# Altium project MBP-GPU-Upgrade.PrjPcb
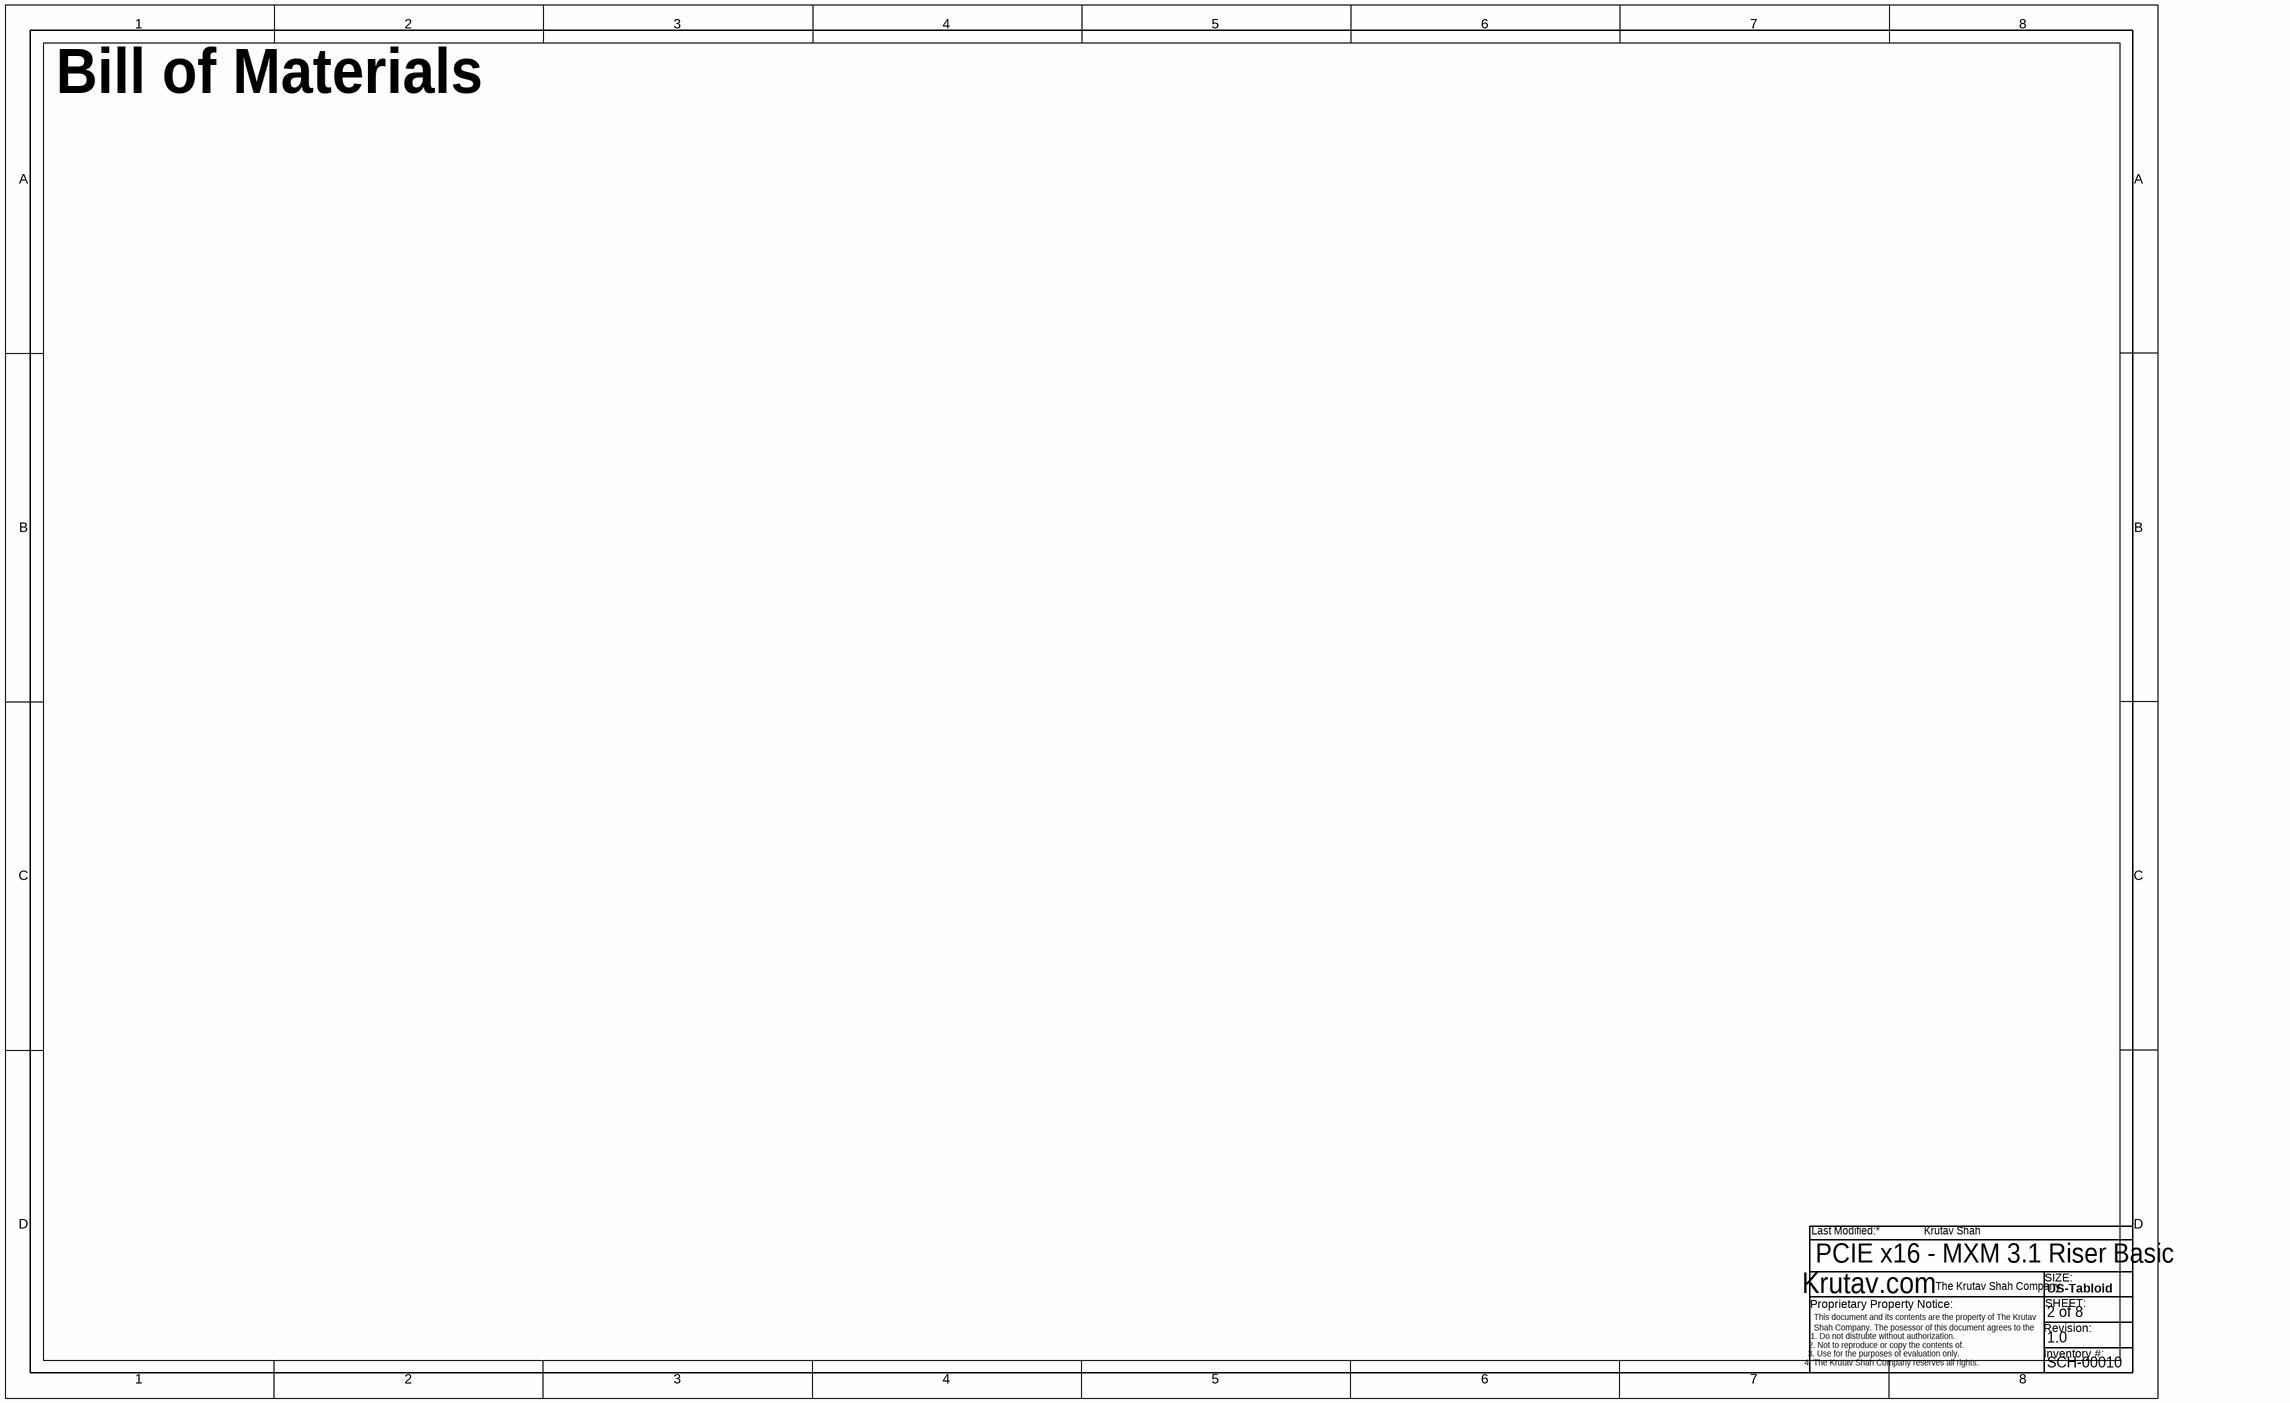
[diagram p0: Bill of Materials.SchDoc]
8 sheets, 29 parts. Net scope: global (net labels, ports and power ports of the same name join across sheets).
Board files: OneLaneSwitchedAdapter.PCBDOC, TwoLaneFastAdapter.PCBDOC
Sheets:
  Bill of Materials.SchDoc
  Block Diagram.SchDoc
  Display Interfaces.SchDoc
  Miscellaneous.SchDoc
  MXM 3.1 Connector Interface.SchDoc
  Power Sources and Supply.SchDoc
  MBP-Wireless-Upgrade.SchDoc
  Table of Contents and Information.SchDoc

## Sheet Bill of Materials.SchDoc
size Tabloid; DrawnBy: Krutav Shah; SheetNumber: 2; SheetTotal: 2; Inventory: SCH-00011

### Notes on the sheet
- Bill of Materials
- PCIE x16 - MXM 3.1 Riser Basic
- 2 of 8
- 1.0
- SCH-00010
- Last Modified:
- Krutav.com
- The Krutav Shah Company
- US-Tabloid
- SIZE:
- SHEET:
- This document and its contents are the property of The Krutav Shah Company. The posessor of this document agrees to the following:
- Proprietary Property Notice:
- 1. Do not distrubte without authorization.
- 3. Use for the purposes of evaluation only.
- 2. Not to reproduce or copy the contents of.
- 4. The Krutav Shah Company reserves all rights.
- Revision:
- Inventory #:

## Sheet Block Diagram.SchDoc
size Tabloid; DrawnBy: Krutav Shah; SheetNumber: 3; SheetTotal: 3
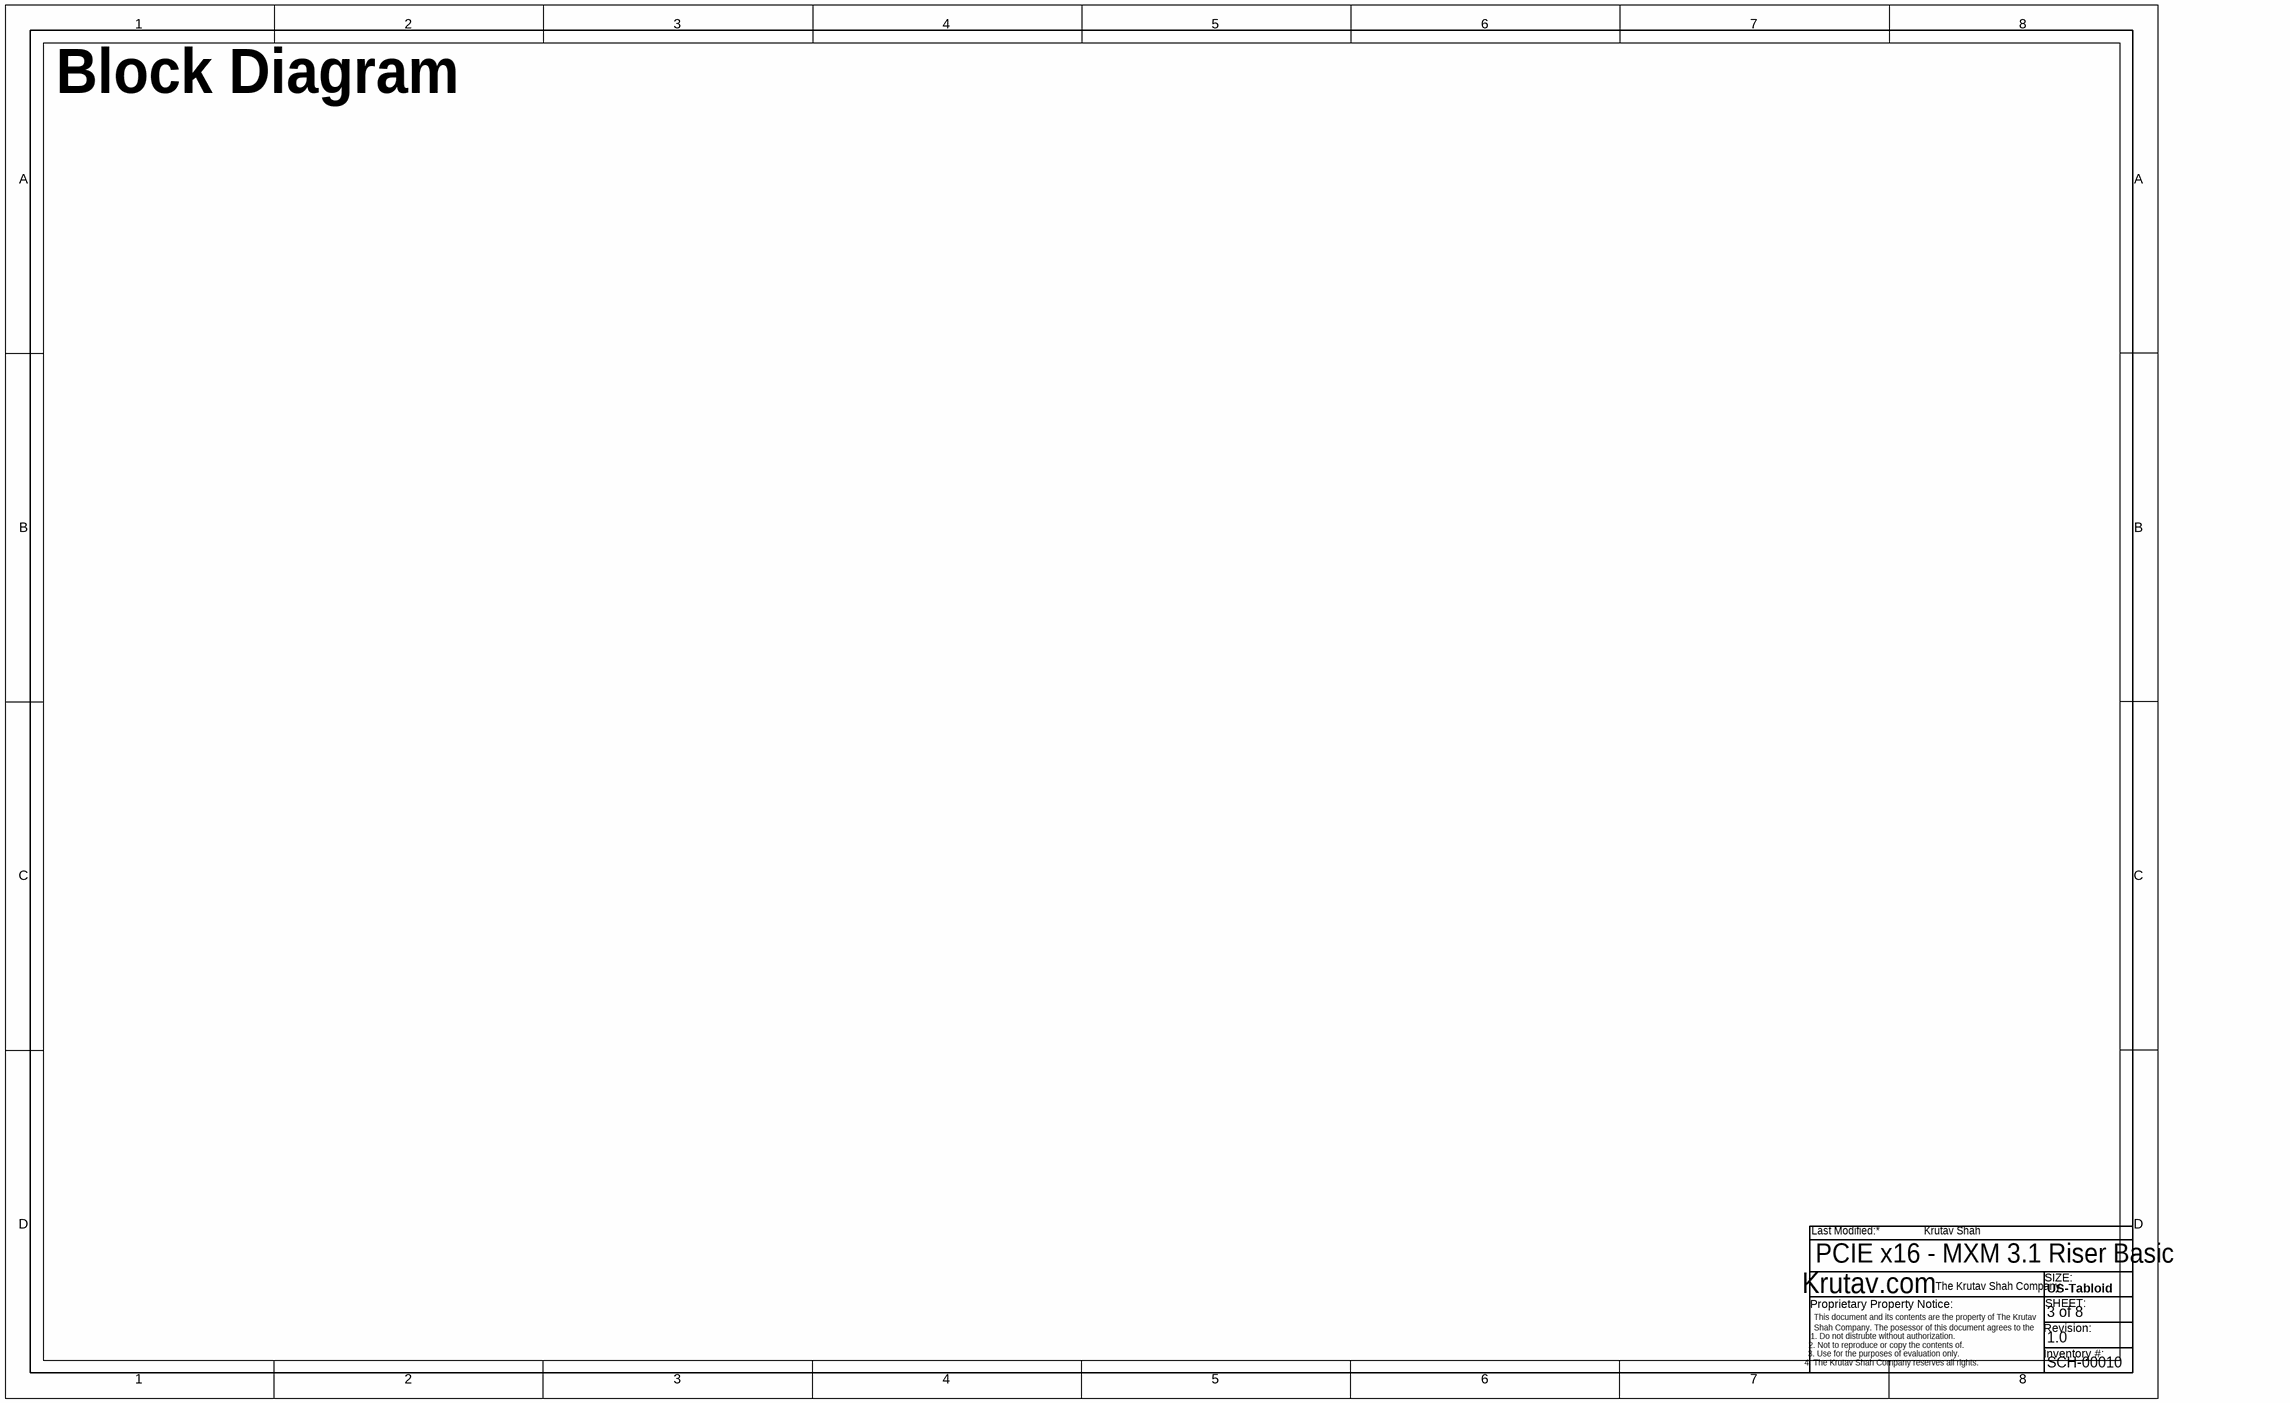
[diagram p1: Block Diagram.SchDoc]

### Notes on the sheet
- Block Diagram
- PCIE x16 - MXM 3.1 Riser Basic
- 3 of 8
- 1.0
- SCH-00010
- Last Modified:
- Krutav.com
- The Krutav Shah Company
- US-Tabloid
- SIZE:
- SHEET:
- This document and its contents are the property of The Krutav Shah Company. The posessor of this document agrees to the following:
- Proprietary Property Notice:
- 1. Do not distrubte without authorization.
- 3. Use for the purposes of evaluation only.
- 2. Not to reproduce or copy the contents of.
- 4. The Krutav Shah Company reserves all rights.
- Revision:
- Inventory #:

## Sheet Display Interfaces.SchDoc
size Tabloid; DrawnBy: Krutav Shah; SheetNumber: 6; SheetTotal: 7
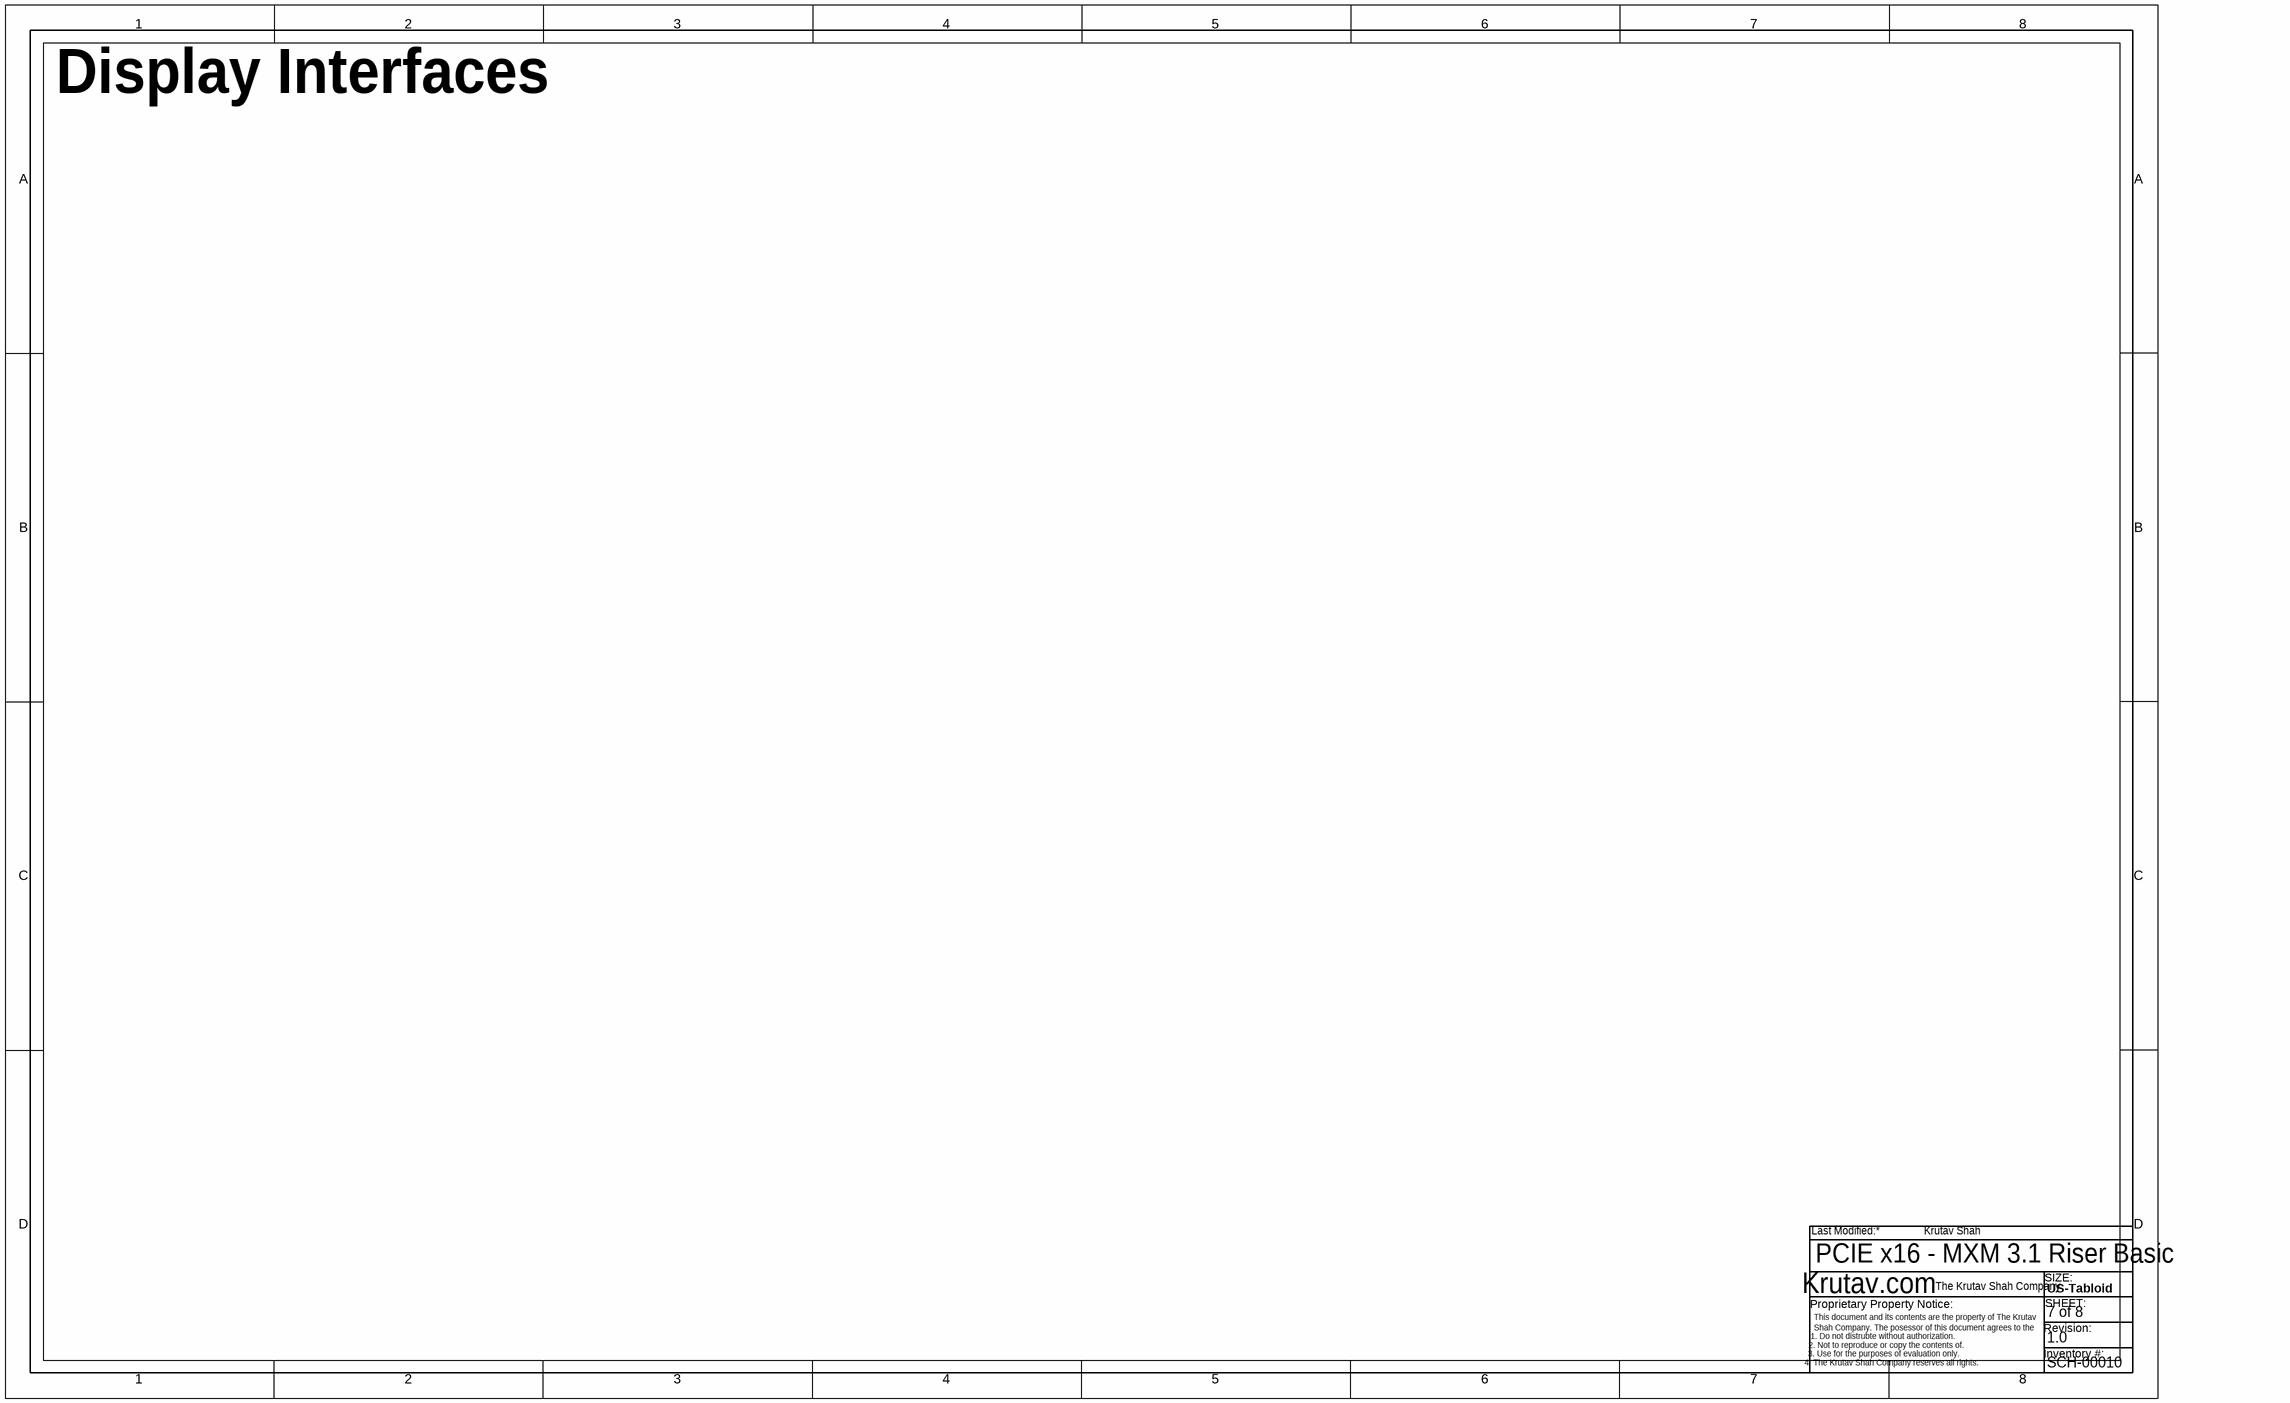
[diagram p2: Display Interfaces.SchDoc]

### Notes on the sheet
- Display Interfaces
- PCIE x16 - MXM 3.1 Riser Basic
- 7 of 8
- 1.0
- SCH-00010
- Last Modified:
- Krutav.com
- The Krutav Shah Company
- US-Tabloid
- SIZE:
- SHEET:
- This document and its contents are the property of The Krutav Shah Company. The posessor of this document agrees to the following:
- Proprietary Property Notice:
- 1. Do not distrubte without authorization.
- 3. Use for the purposes of evaluation only.
- 2. Not to reproduce or copy the contents of.
- 4. The Krutav Shah Company reserves all rights.
- Revision:
- Inventory #:

## Sheet Miscellaneous.SchDoc
size Tabloid; DrawnBy: Krutav Shah; SheetNumber: 4; SheetTotal: 6
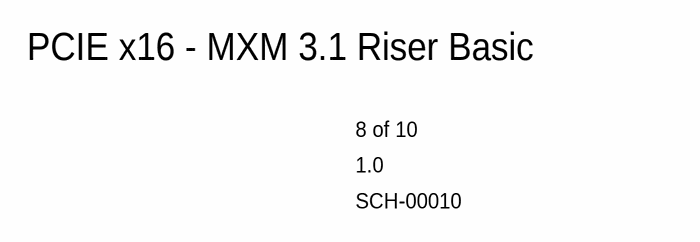
[diagram p3: Miscellaneous.SchDoc]

### Notes on the sheet
- PCIE x16 - MXM 3.1 Riser Basic
- 8 of 10
- 1.0
- SCH-00010
- Last Modified:
- Krutav.com
- The Krutav Shah Company
- US-Tabloid
- SIZE:
- SHEET:
- This document and its contents are the property of The Krutav Shah Company. The posessor of this document agrees to the following:
- Proprietary Property Notice:
- 1. Do not distrubte without authorization.
- 3. Use for the purposes of evaluation only.
- 2. Not to reproduce or copy the contents of.
- 4. The Krutav Shah Company reserves all rights.
- Revision:
- Inventory #:

## Sheet MXM 3.1 Connector Interface.SchDoc
size Tabloid; DrawnBy: Krutav Shah; SheetNumber: 4; SheetTotal: 6
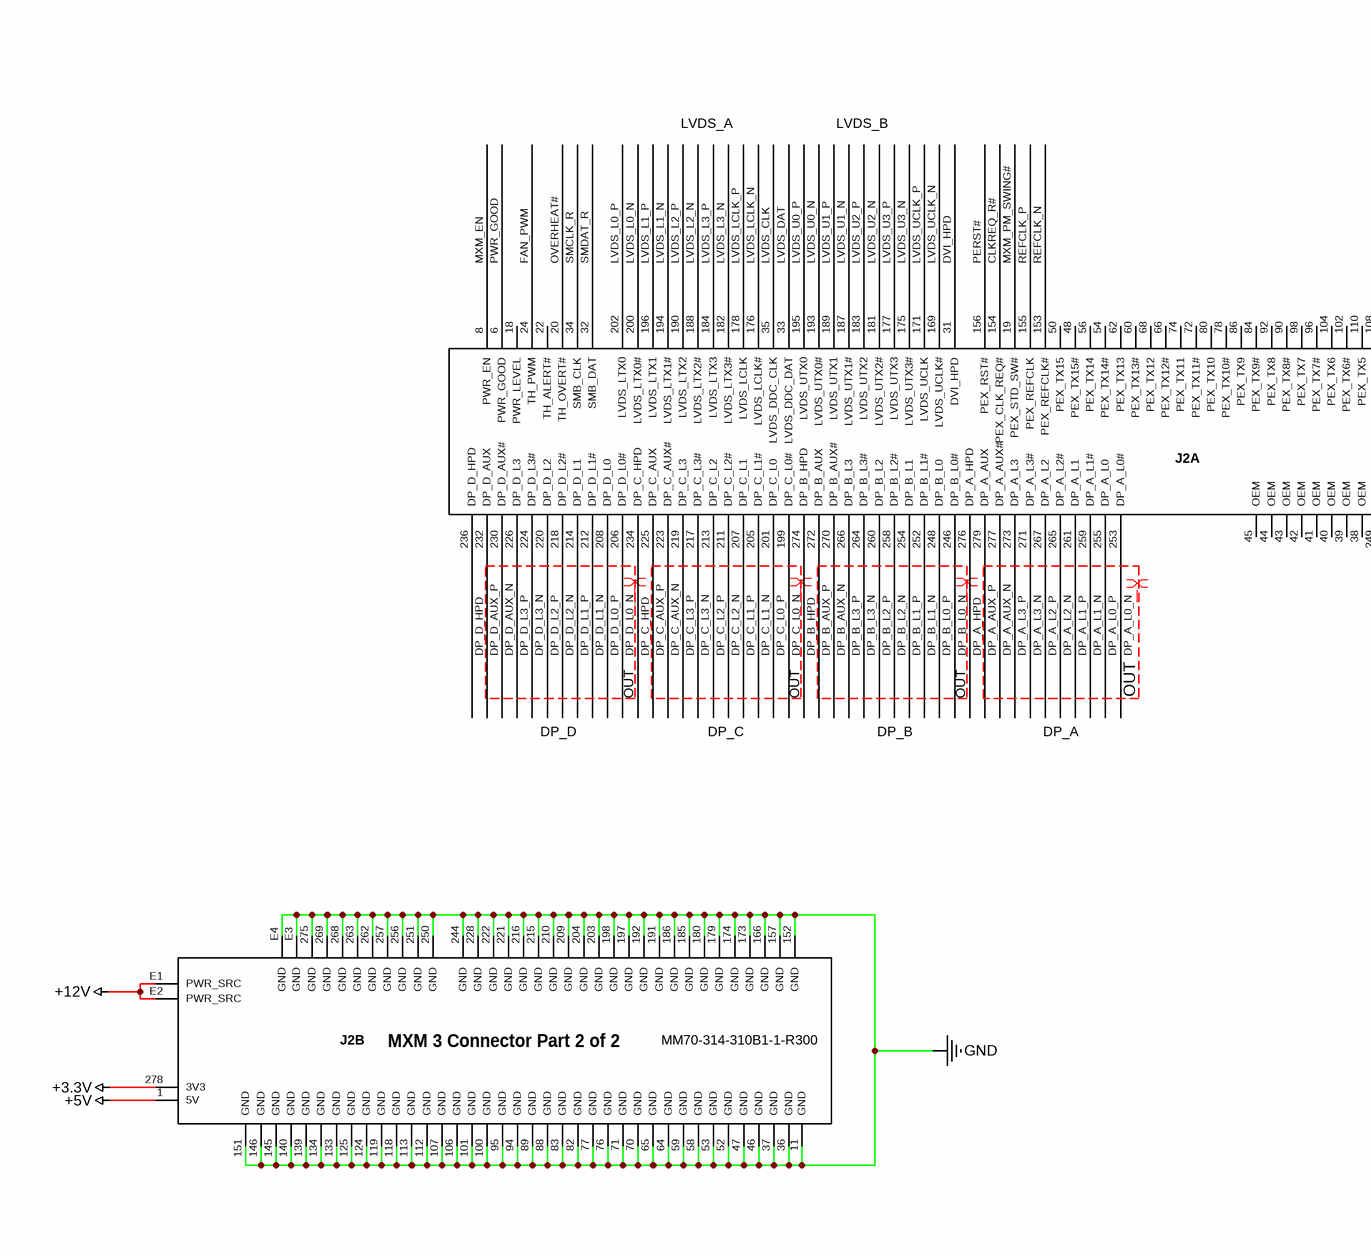
[diagram p4: MXM 3.1 Connector Interface.SchDoc, left]
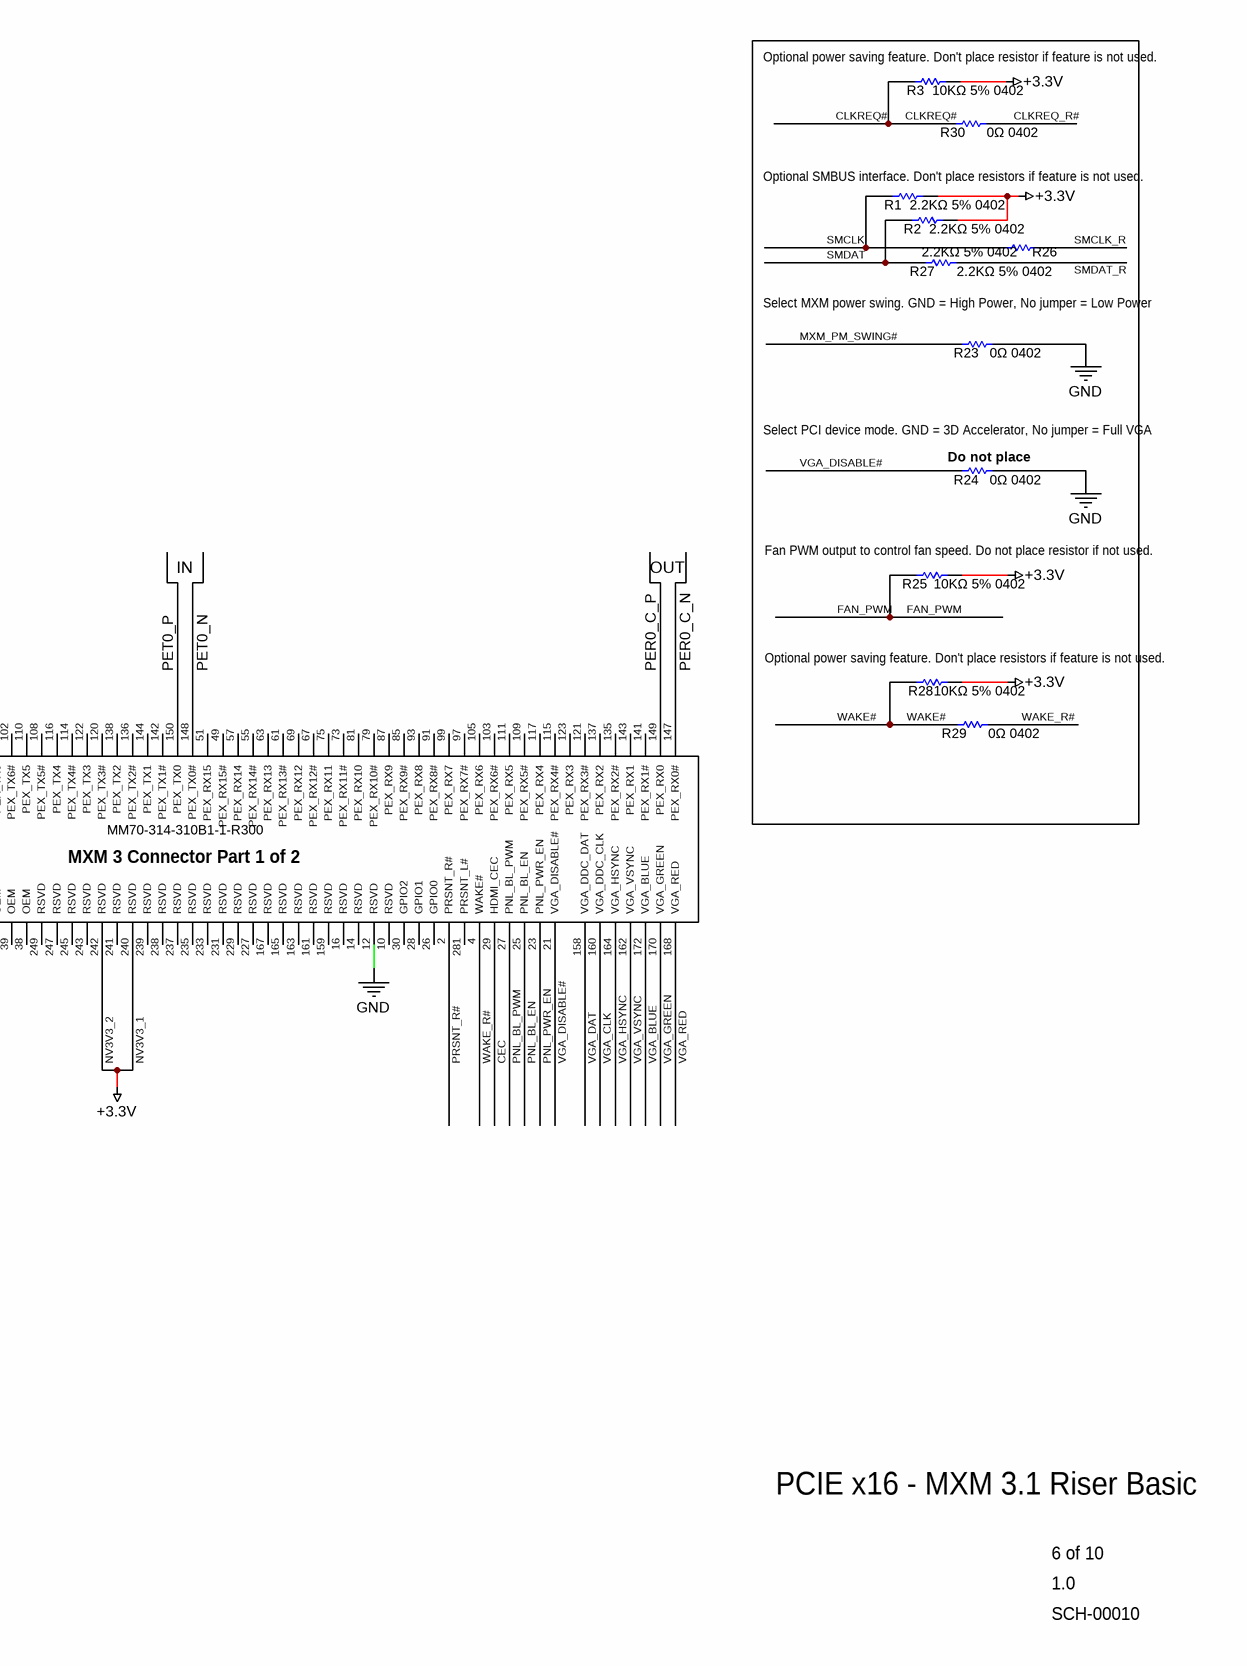
[diagram p5: MXM 3.1 Connector Interface.SchDoc, right]

### Parts
(Parts that share a designator on the sheet are numbered #1, #2 ... from top to bottom, then left to right.)
J2#1  MM70-314-310B1-1-R300  [JAE_MM70-314-310B1-2-R300]  (parts A,B of 2)
R1  2.2KΩ 5% 0402  [RESC0201(0603)_L]
R2  2.2KΩ 5% 0402  [RESC0201(0603)_L]
R3  10KΩ 5% 0402  [RESC0201(0603)_L]
R23  0Ω 0402  [RESC0201(0603)_L]
R24  0Ω 0402  [RESC0201(0603)_L]
R25  10KΩ 5% 0402  [RESC0201(0603)_L]
R26  2.2KΩ 5% 0402  [RESC0201(0603)_L]
R27  2.2KΩ 5% 0402  [RESC0201(0603)_L]
R28  10KΩ 5% 0402  [RESC0201(0603)_L]
R29  0Ω 0402  [RESC0201(0603)_L]
R30  0Ω 0402  [RESC0201(0603)_L]

### Blocks framed on the sheet
Do not place: R1-R3 R23-R30

### Nets
+5V: J2#1.1(5V)
+12V: J2#1.E1(PWR_SRC) J2#1.E2(PWR_SRC)
GND: J2#1.11(GND) J2#1.12(RSVD) J2#1.36(GND) J2#1.37(GND) J2#1.46(GND) J2#1.47(GND) J2#1.52(GND) J2#1.53(GND) J2#1.58(GND) J2#1.59(GND) J2#1.64(GND) J2#1.65(GND) J2#1.70(GND) J2#1.71(GND) J2#1.76(GND) J2#1.77(GND) J2#1.82(GND) J2#1.83(GND) J2#1.88(GND) J2#1.89(GND) J2#1.94(GND) J2#1.95(GND) J2#1.100(GND) J2#1.101(GND) J2#1.106(GND) J2#1.107(GND) J2#1.112(GND) J2#1.113(GND) J2#1.118(GND) J2#1.119(GND) J2#1.124(GND) J2#1.125(GND) J2#1.133(GND) J2#1.134(GND) J2#1.139(GND) J2#1.140(GND) J2#1.145(GND) J2#1.146(GND) J2#1.151(GND) J2#1.152(GND) J2#1.157(GND) J2#1.166(GND) J2#1.173(GND) J2#1.174(GND) J2#1.179(GND) J2#1.180(GND) J2#1.185(GND) J2#1.186(GND) J2#1.191(GND) J2#1.192(GND) J2#1.197(GND) J2#1.198(GND) J2#1.203(GND) J2#1.204(GND) J2#1.209(GND) J2#1.210(GND) J2#1.215(GND) J2#1.216(GND) J2#1.221(GND) J2#1.222(GND) J2#1.228(GND) J2#1.244(GND) J2#1.250(GND) J2#1.251(GND) J2#1.256(GND) J2#1.257(GND) J2#1.262(GND) J2#1.263(GND) J2#1.268(GND) J2#1.269(GND) J2#1.275(GND) J2#1.E3(GND) J2#1.E4(GND) R23.1 R24.1
NV3V3_1: J2#1.240(RSVD) J2#1.242(RSVD) J2#1.278(3V3) R1.1 R2.1 R3.1 R25.1 R28.1  [also labelled +3.3V, NV3V3_2]
CEC: J2#1.29(HDMI_CEC)
CLKREQ#: R3.2 R30.2
CLKREQ_R#: J2#1.154(PEX_CLK_REQ#) R30.1
DP_A_AUX_N: J2#1.277(DP_A_AUX#)
DP_A_AUX_P: J2#1.279(DP_A_AUX)
DP_A_HPD: J2#1.276(DP_A_HPD)
DP_A_L0_N: J2#1.253(DP_A_L0#)
DP_A_L0_P: J2#1.255(DP_A_L0)
DP_A_L1_N: J2#1.259(DP_A_L1#)
DP_A_L1_P: J2#1.261(DP_A_L1)
DP_A_L2_N: J2#1.265(DP_A_L2#)
DP_A_L2_P: J2#1.267(DP_A_L2)
DP_A_L3_N: J2#1.271(DP_A_L3#)
DP_A_L3_P: J2#1.273(DP_A_L3)
DP_B_AUX_N: J2#1.270(DP_B_AUX#)
DP_B_AUX_P: J2#1.272(DP_B_AUX)
DP_B_HPD: J2#1.274(DP_B_HPD)
DP_B_L0_N: J2#1.246(DP_B_L0#)
DP_B_L0_P: J2#1.248(DP_B_L0)
DP_B_L1_N: J2#1.252(DP_B_L1#)
DP_B_L1_P: J2#1.254(DP_B_L1)
DP_B_L2_N: J2#1.258(DP_B_L2#)
DP_B_L2_P: J2#1.260(DP_B_L2)
DP_B_L3_N: J2#1.264(DP_B_L3#)
DP_B_L3_P: J2#1.266(DP_B_L3)
DP_C_AUX_N: J2#1.223(DP_C_AUX#)
DP_C_AUX_P: J2#1.225(DP_C_AUX)
DP_C_HPD: J2#1.234(DP_C_HPD)
DP_C_L0_N: J2#1.199(DP_C_L0#)
DP_C_L0_P: J2#1.201(DP_C_L0)
DP_C_L1_N: J2#1.205(DP_C_L1#)
DP_C_L1_P: J2#1.207(DP_C_L1)
DP_C_L2_N: J2#1.211(DP_C_L2#)
DP_C_L2_P: J2#1.213(DP_C_L2)
DP_C_L3_N: J2#1.217(DP_C_L3#)
DP_C_L3_P: J2#1.219(DP_C_L3)
DP_D_AUX_N: J2#1.230(DP_D_AUX#)
DP_D_AUX_P: J2#1.232(DP_D_AUX)
DP_D_HPD: J2#1.236(DP_D_HPD)
DP_D_L0_N: J2#1.206(DP_D_L0#)
DP_D_L0_P: J2#1.208(DP_D_L0)
DP_D_L1_N: J2#1.212(DP_D_L1#)
DP_D_L1_P: J2#1.214(DP_D_L1)
DP_D_L2_N: J2#1.218(DP_D_L2#)
DP_D_L2_P: J2#1.220(DP_D_L2)
DP_D_L3_N: J2#1.224(DP_D_L3#)
DP_D_L3_P: J2#1.226(DP_D_L3)
DVI_HPD: J2#1.31(DVI_HPD)
FAN_PWM: J2#1.24(TH_PWM) R25.2
LVDS_CLK: J2#1.35(LVDS_DDC_CLK)
LVDS_DAT: J2#1.33(LVDS_DDC_DAT)
LVDS_L0_N: J2#1.200(LVDS_LTX0#)
LVDS_L0_P: J2#1.202(LVDS_LTX0)
LVDS_L1_N: J2#1.194(LVDS_LTX1#)
LVDS_L1_P: J2#1.196(LVDS_LTX1)
LVDS_L2_N: J2#1.188(LVDS_LTX2#)
LVDS_L2_P: J2#1.190(LVDS_LTX2)
LVDS_L3_N: J2#1.182(LVDS_LTX3#)
LVDS_L3_P: J2#1.184(LVDS_LTX3)
LVDS_LCLK_N: J2#1.176(LVDS_LCLK#)
LVDS_LCLK_P: J2#1.178(LVDS_LCLK)
LVDS_U0_N: J2#1.193(LVDS_UTX0#)
LVDS_U0_P: J2#1.195(LVDS_UTX0)
LVDS_U1_N: J2#1.187(LVDS_UTX1#)
LVDS_U1_P: J2#1.189(LVDS_UTX1)
LVDS_U2_N: J2#1.181(LVDS_UTX2#)
LVDS_U2_P: J2#1.183(LVDS_UTX2)
LVDS_U3_N: J2#1.175(LVDS_UTX3#)
LVDS_U3_P: J2#1.177(LVDS_UTX3)
LVDS_UCLK_N: J2#1.169(LVDS_UCLK#)
LVDS_UCLK_P: J2#1.171(LVDS_UCLK)
MXM_EN: J2#1.8(PWR_EN)
MXM_PM_SWING#: J2#1.19(PEX_STD_SW#) R23.2
OVERHEAT#: J2#1.20(TH_OVERT#)
PER0_C_N: J2#1.147(PEX_RX0#)
PER0_C_P: J2#1.149(PEX_RX0)
PERST#: J2#1.156(PEX_RST#)
PET0_N: J2#1.148(PEX_TX0#)
PET0_P: J2#1.150(PEX_TX0)
PNL_BL_EN: J2#1.25(PNL_BL_EN)
PNL_BL_PWM: J2#1.27(PNL_BL_PWM)
PNL_PWR_EN: J2#1.23(PNL_PWR_EN)
PRSNT_R#: J2#1.2(PRSNT_R#)
PWR_GOOD: J2#1.6(PWR_GOOD)
REFCLK_N: J2#1.153(PEX_REFCLK#)
REFCLK_P: J2#1.155(PEX_REFCLK)
SMCLK: R1.2 R26.2
SMCLK_R: J2#1.34(SMB_CLK) R26.1
SMDAT: R2.2 R27.2
SMDAT_R: J2#1.32(SMB_DAT) R27.1
VGA_BLUE: J2#1.172(VGA_BLUE)
VGA_CLK: J2#1.160(VGA_DDC_CLK)
VGA_DAT: J2#1.158(VGA_DDC_DAT)
VGA_DISABLE#: J2#1.21(VGA_DISABLE#) R24.2
VGA_GREEN: J2#1.170(VGA_GREEN)
VGA_HSYNC: J2#1.164(VGA_HSYNC)
VGA_RED: J2#1.168(VGA_RED)
VGA_VSYNC: J2#1.162(VGA_VSYNC)
WAKE#: R28.2 R29.2
WAKE_R#: J2#1.4(WAKE#) R29.1

Not connected (* = marked no-connect by the designer): J2#1 10(RSVD) 14(RSVD) 16(RSVD) 18(PWR_LEVEL) 22(TH_ALERT#) 26(GPIO0) 28(GPIO1) 30(GPIO2) 38(OEM) 39(OEM) 40(OEM) 41(OEM) 42(OEM) 43(OEM) 44(OEM) 45(OEM) 48(PEX_TX15#) 49(PEX_RX15#) 50(PEX_TX15) 51(PEX_RX15) 54(PEX_TX14#) 55(PEX_RX14#) 56(PEX_TX14) 57(PEX_RX14) 60(PEX_TX13#) 61(PEX_RX13#) 62(PEX_TX13) 63(PEX_RX13) 66(PEX_TX12#) 67(PEX_RX12#) 68(PEX_TX12) 69(PEX_RX12) 72(PEX_TX11#) 73(PEX_RX11#) 74(PEX_TX11) 75(PEX_RX11) 78(PEX_TX10#) 79(PEX_RX10#) 80(PEX_TX10) 81(PEX_RX10) 84(PEX_TX9#) 85(PEX_RX9#) 86(PEX_TX9) 87(PEX_RX9) 90(PEX_TX8#) 91(PEX_RX8#) 92(PEX_TX8) 93(PEX_RX8) 96(PEX_TX7#) 97(PEX_RX7#) 98(PEX_TX7) 99(PEX_RX7) 102(PEX_TX6#) 103(PEX_RX6#) 104(PEX_TX6) 105(PEX_RX6) 108(PEX_TX5#) 109(PEX_RX5#) 110(PEX_TX5) 111(PEX_RX5) 114(PEX_TX4#) 115(PEX_RX4#) 116(PEX_TX4) 117(PEX_RX4) 120(PEX_TX3#) 121(PEX_RX3#) 122(PEX_TX3) 123(PEX_RX3) 135(PEX_RX2#) 136(PEX_TX2#) 137(PEX_RX2) 138(PEX_TX2) 141(PEX_RX1#) 142(PEX_TX1#) 143(PEX_RX1) 144(PEX_TX1) 159(RSVD) 161(RSVD) 163(RSVD) 165(RSVD) 167(RSVD) 227(RSVD) 229(RSVD) 231(RSVD) 233(RSVD) 235(RSVD) 237(RSVD) 238(RSVD) 239(RSVD) 241(RSVD) 243(RSVD) 245(RSVD) 247(RSVD) 249(RSVD) 281(PRSNT_L#)

### Layout directives
differential pair: DP_A_AUX_N, DP_A_AUX_P, DP_A_L0_N, DP_A_L0_P, DP_A_L1_N, DP_A_L1_P, DP_A_L2_N, DP_A_L2_P, DP_A_L3_N, DP_A_L3_P, DP_B_AUX_N, DP_B_AUX_P, DP_B_L0_N, DP_B_L0_P, DP_B_L1_N, DP_B_L1_P, DP_B_L2_N, DP_B_L2_P, DP_B_L3_N, DP_B_L3_P, DP_C_AUX_N, DP_C_AUX_P, DP_C_L0_N, DP_C_L0_P, DP_C_L1_N, DP_C_L1_P, DP_C_L2_N, DP_C_L2_P, DP_C_L3_N, DP_C_L3_P, DP_D_AUX_N, DP_D_AUX_P, DP_D_L0_N, DP_D_L0_P, DP_D_L1_N, DP_D_L1_P, DP_D_L2_N, DP_D_L2_P, DP_D_L3_N, DP_D_L3_P, LVDS_L0_N, LVDS_L0_P, LVDS_L1_N, LVDS_L1_P, LVDS_L2_N, LVDS_L2_P, LVDS_L3_N, LVDS_L3_P, LVDS_LCLK_N, LVDS_LCLK_P, LVDS_U0_N, LVDS_U0_P, LVDS_U1_N, LVDS_U1_P, LVDS_U2_N, LVDS_U2_P, LVDS_U3_N, LVDS_U3_P, LVDS_UCLK_N, LVDS_UCLK_P, PER0_C_N, PER0_C_P, PET0_N, PET0_P, REFCLK_N, REFCLK_P

### Notes on the sheet
- (near R3) Optional power saving feature. Don't place resistor if feature is not used.
- (near R1) Optional SMBUS interface. Don't place resistors if feature is not used.
- Select MXM power swing. GND = High Power, No jumper = Low Power
- (near R24) Select PCI device mode. GND = 3D Accelerator, No jumper = Full VGA
- LVDS_A
- LVDS_B
- (near R25) Fan PWM output to control fan speed. Do not place resistor if not used.
- IN
- OUT
- (near R28) Optional power saving feature. Don't place resistors if feature is not used.
- DP_D
- DP_C
- DP_B
- DP_A
- PCIE x16 - MXM 3.1 Riser Basic
- 6 of 10
- 1.0
- SCH-00010
- Last Modified:
- Krutav.com
- The Krutav Shah Company
- US-Tabloid
- SIZE:
- SHEET:
- This document and its contents are the property of The Krutav Shah Company. The posessor of this document agrees to the following:
- Proprietary Property Notice:
- 1. Do not distrubte without authorization.
- 3. Use for the purposes of evaluation only.
- 2. Not to reproduce or copy the contents of.
- 4. The Krutav Shah Company reserves all rights.
- Revision:
- Inventory #:
- (in symbol MM70-314-310B1-1-R300, part A) MXM 3 Connector Part 1 of 2
- (in symbol MM70-314-310B1-1-R300, part B) MXM 3 Connector Part 2 of 2

### Library data of the parts
J2#1 = MM70-314-310B1-1-R300: 314 Position Female Connector MXM 3.0 Gold 0.020 _0.50mm_ Black; MF: JAE Electronics; Package: None; Digi-Key_Part_Number: 670-2431-1-ND; Digi-Key_Purchase_URL: https://www.digikey.com/product-detail/en/jae-electronics/MM70-314-310B1-1-R300/670-2431-1-ND/2183605?utm_source=snapeda&utm_medium=aggregator&utm_campaign=symbol; Value: *; MP: MM70-314-310B1-1-R300; SnapEDA_Link: https://www.snapeda.com/parts/MM70-314-310B1-1-R300/JAE%20Electronics/view-part/553386/?ref=snap
R1-R3 R23-R30 = CMP-1010-00755-1: 1M 0.05W 1% 0201 (0603 Metric)  SMD; Case-Metric: 0603; Value: 1000000.00 Ohm; Case-EIA: 0201; Technology: SMT; Tolerance: 1 %; Power: 0.05 W

## Sheet Power Sources and Supply.SchDoc
size Tabloid; DrawnBy: Krutav Shah; SheetNumber: 4; SheetTotal: 6
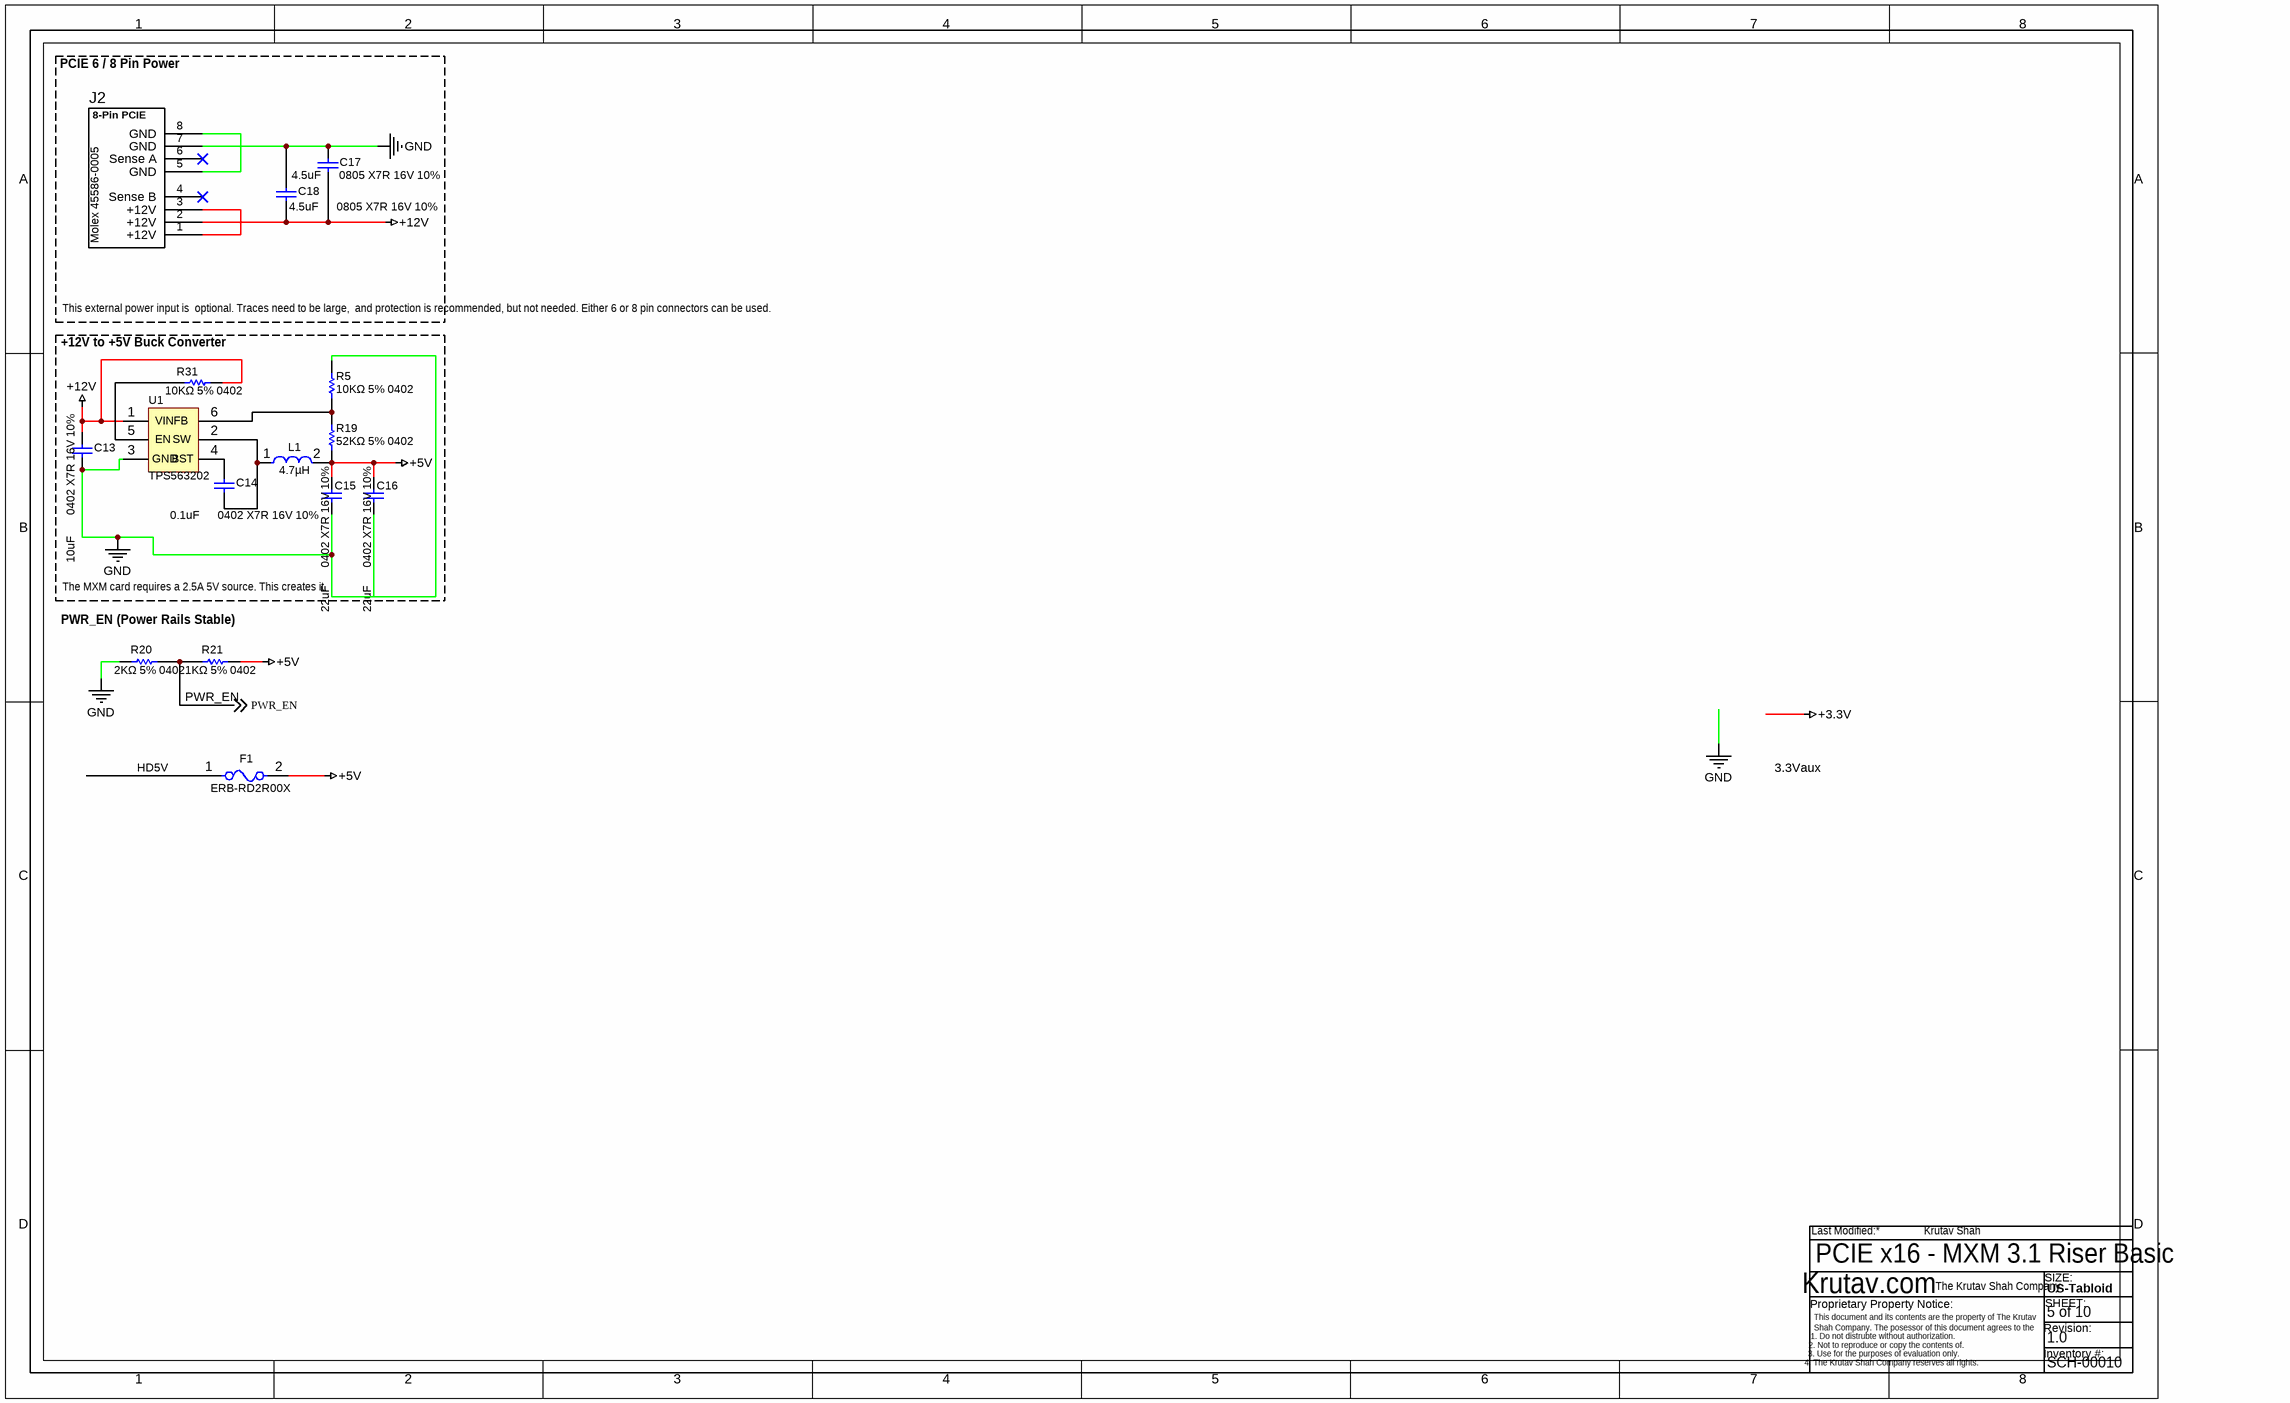
[diagram p6: Power Sources and Supply.SchDoc]

### Parts
(Parts that share a designator on the sheet are numbered #1, #2 ... from top to bottom, then left to right.)
C13  10uF       0402 X7R 16V 10%  [CAPC0603X33X15NL03T05]
C14  0.1uF      0402 X7R 16V 10%  [CAPC0603X33X15NL03T05]
C15  22uF      0402 X7R 16V 10%  [CAPC0603X33X15NL03T05]
C16  22uF      0402 X7R 16V 10%  [CAPC0603X33X15NL03T05]
C17  4.5uF      0805 X7R 16V 10%  [CAPC0603X33X15NL03T05]
C18  4.5uF      0805 X7R 16V 10%  [CAPC0603X33X15NL03T05]
F1  ERB-RD2R00X  [FP-ERBRD-MFG]
J2#2  MOLEX 45586-0005  [Molex_45586-8-Pin-PWR]  (value not drawn)
L1  4.7µH  [FP-IHLP-4040DZ-FP_3_124x3-MFG]
R5  10KΩ 5% 0402  [RESC0201(0603)_L]
R19  52KΩ 5% 0402  [RESC0201(0603)_L]
R20  2KΩ 5% 0402  [RESC0201(0603)_L]
R21  1KΩ 5% 0402  [RESC0201(0603)_L]
R31  10KΩ 5% 0402  [RESC0201(0603)_L]
U1  TPS563202  [ONSC-SOT-563-6-463A-01_V]

### Blocks framed on the sheet
PCIE 6 / 8 Pin Power: C17 C18 J2#2
+12V to +5V Buck Converter: C13-C16 L1 R5 R19 R31 U1

### Nets
+5V: C15.1 C16.1 F1.2 L1.2 R19.1 R21.2
+12V: C13.2 C17.1 C18.1 J2#2.2(+12V) R31.1 U1.1(VIN)
GND: C13.1 C15.2 C17.2 C18.2 J2#2.7(GND) R5.1 R20.1 U1.3(GND)
PWR_EN: R20.2 R21.1 ; off-sheet PWR_EN
NetC14_1: C14.1 L1.1 U1.2(SW)
NetC14_2: C14.2 U1.4(BST)
NetJ2#2_1: J2#2.1(+12V) J2#2.3(+12V)
NetJ2#2_5: J2#2.5(GND) J2#2.8(GND)
NetR5_2: R5.2 R19.2 U1.6(FB)
NetR31_2: R31.2 U1.5(EN)

Not connected (* = marked no-connect by the designer): C16 2; F1 1; J2#2 4(Sense_B)* 6(Sense_A)*

### Notes on the sheet
- This external power input is
  optional. Traces need to be large,
  and protection is recommended,
  but not needed. Either 6 or 8 pin connectors can be used.
- The MXM card requires a 2.5A 5V source. This creates it.
- PWR_EN (Power Rails Stable)
- HD5V
- PCIE x16 - MXM 3.1 Riser Basic
- 5 of 10
- 1.0
- SCH-00010
- Labels drawn without touching a wire or pin: 3.3Vaux
- Last Modified:
- Krutav.com
- The Krutav Shah Company
- US-Tabloid
- SIZE:
- SHEET:
- This document and its contents are the property of The Krutav Shah Company. The posessor of this document agrees to the following:
- Proprietary Property Notice:
- 1. Do not distrubte without authorization.
- 3. Use for the purposes of evaluation only.
- 2. Not to reproduce or copy the contents of.
- 4. The Krutav Shah Company reserves all rights.
- Revision:
- Inventory #:
- (in symbol Component_1) 8-Pin PCIE; Molex 45586-0005

### Library data of the parts
C13-C18 = CMP-2010-00679-1: Manufacturer: Samsung; Part Number: CL03A224MQ3NNNC
F1 = CMP-05590-000001-1: FUSE BOARD MOUNT 2A 32VDC 0402; Manufacturer: Panasonic Electronic Components; Resistance: 53mΩ; Value: 53mΩ; Voltage Rating: 32V; Fuse Interrupt Dc Current: 35A; Fuse Blow Speed: Fast; Digikey Description: FUSE BOARD MOUNT 2A 32VDC 0402; ComponentLink2Description: Datasheet; Fuse Current: 2A; Device Class L2: Fuses; Category: Fuse; Octopart: https://octopart.com/erb-rd2r00x-panasonic-21220532; RoHS: TRUE; Device Class L1: Circuit Protection; Temperature Range High: +125°C; Height: 0.49mm; Device Class L3: unset; Max Fuse Dc Voltage: 32V; Automotive: No; Manufacturer Part Number: ERB-RD2R00X; Lead Free: Yes; Temperature Range Low: -40°C; Mouser Description: Surface Mount Fuses 2A 0402 micro chip; ComponentLink2URL: https://industrial.panasonic.com/cdbs/www-data/pdf/AFA0000/AFA0000C7.pdf; Temperature: -40°C to +125°C; Package: ERBRD
J2#2 = Component_1
L1 = CMP-02424-000263-1: Commercial Inductors, High Saturation Series 3.3uH 10A 14.4mΩ 20%; Test Frequency: 100kHz; DC Resistance (DCR): 14.4mR; Shielding: Shielded; Max DC Current: 18.6A; Core Material: Metal; Self Resonant Frequency: 5MHz; Width: 0.405inch; RMS Current (Irms): 10A; Weight: 0.070548oz; Number of Pins: 4040; Height: 4mm; Tolerance: 20%; Contact Plating: Tin; Termination: SMD/SMT; Case Code (Imperial): 4040; Length: 0.43inch; Lead Free: Lead Free; Military Standard: Not; Depth: 10.3mm; Mount: Surface Mount; Radiation Hardening: No; Current Rating: 10A; Min Operating Temperature: -55°C; Height - Seated (Max): 0.157inch; Max Operating Temperature: 125°C; Inductance Tolerance: 20%; Packaging: Tape and Reel; Case/Package: 4040; Package Quantity: 500; Inductance: 3.3uH; Saturation Current: 18.6A
R5 R19-R21 R31 = CMP-1010-00755-1: as R1 on sheet MXM 3.1 Connector Interface; Technology: SMT; Tolerance: 1 %; Power: 0.05 W
U1 = CMP-1063-00200-1: Transient Voltage Suppressor, ESD Protection Diodes with Low Clamping Voltage, 6-Pin SOT-563, Pb-Free, Tape and Reel; PartNumber: NUP4114UPXV6T1G; Manufacturer: On Semiconductor; V(BR) Min (V): 5.5; Direction: Unidirectional; Number of Lines: 4; IR Max (uA): 1; PackageVersion: Rev. F, 04/2005; VRWM Max (V): 5.5; PackageReference: SOT-563-6-463A-01; ComponentLink3URL: http://www.onsemi.cn/pub_link/Collateral/463A-01.PDF; ComponentLink2URL: http://www.onsemi.com/pub_link/Collateral/NUP4114-D.PDF; PackageDescription: 6-Pin Small Outline Transistor, Body 1.6 x 1.2 mm, Pitch 0.5 mm; Packing: Tape and Reel; ComponentLink1Description: Manufacturer URL; ComponentLink3Description: Package Specification; RoHS: Pb-Free; Mounting Technology: Surface Mount; DatasheetVersion: Rev. 2; ComponentLink2Description: Datasheet; ComponentLink1URL: http://www.onsemi.com/

## Sheet MBP-Wireless-Upgrade.SchDoc
size Letter
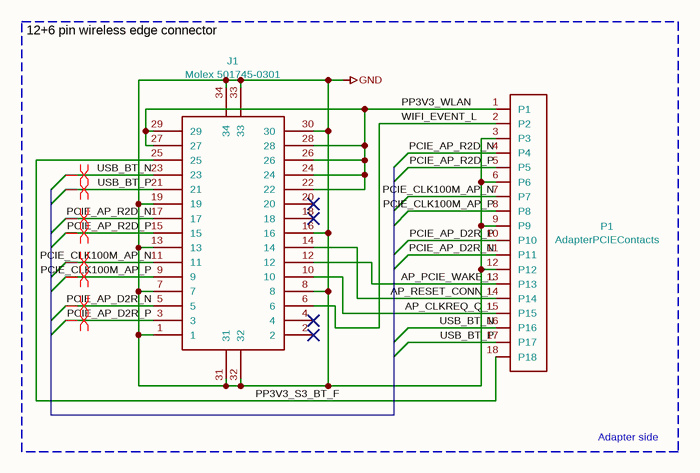
[diagram p7: MBP-Wireless-Upgrade.SchDoc]

### Parts
J1  Molex 501745-0301  [5017450301]
P1  AdapterPCIEContacts  [Edge Connector]

### Blocks framed on the sheet
12+6 pin wireless edge connector: J1 P1

### Nets
GND: J1.1 J1.7 J1.8 J1.13 J1.16 J1.19 J1.30 J1.31 J1.32 J1.33 J1.34 P1.3(P3) P1.6(P6) P1.9(P9) P1.12(P12)
AP_CLKREQ_Q_L: J1.10 P1.15(P15)
AP_PCIE_WAKE_L: J1.12 P1.13(P13)
AP_RESET_CONN_L: J1.14 P1.14(P14)
PCIE_AP_D2R_N: J1.5 P1.11(P11)
PCIE_AP_D2R_P: J1.3 P1.10(P10)
PCIE_AP_R2D_N: J1.17 P1.4(P4)
PCIE_AP_R2D_P: J1.15 P1.5(P5)
PCIE_CLK100M_AP_N: J1.11 P1.7(P7)
PCIE_CLK100M_AP_P: J1.9 P1.8(P8)
PP3V3_S3_BT_F: J1.25 P1.18(P18)
PP3V3_WLAN: J1.22 J1.24 J1.26 J1.27 J1.28 J1.29 P1.1(P1)
USB_BT_N: J1.23 P1.16(P16)
USB_BT_P: J1.21 P1.17(P17)
WIFI_EVENT_L: J1.6 P1.2(P2)

Not connected (* = marked no-connect by the designer): J1 2* 4* 18* 20*

### Layout directives
differential pair: PCIE_AP_D2R_N, PCIE_AP_D2R_P, PCIE_AP_R2D_N, PCIE_AP_R2D_P, PCIE_CLK100M_AP_N, PCIE_CLK100M_AP_P, USB_BT_N, USB_BT_P

### Notes on the sheet
- Adapter side
- Drawn by:
- Krutav.com
- The Krutav Shah Company
- SIZE:
- SHEET:
- US-Letter
- This document and its contents are the property of The Krutav Shah Company. The posessor of this document agrees to the following:
- Proprietary Property Notice:
- 1. Do not distrubte without authorization.
- 3. Use for the purposes of evaluation only.
- 2. Not to reproduce or copy the contents of.
- 4. The Krutav Shah Company reserves all rights.
- Revision:
- Inventory #:

### Library data of the parts
J1 = 501745-0301: Height: 1.64; Mouser Part Number: 538-501745-0301; Mouser Price/Stock: https://www.mouser.com/Search/Refine.aspx?Keyword=538-501745-0301; Manufacturer_Name: Molex; Manufacturer_Part_Number: 501745-0301; Value: Molex 501745-0301
P1 = AdapterPCIEContacts: Value: AdapterPCIEContacts; Footprint: MBPWirelessUpgrade:Edge Connector

## Sheet Table of Contents and Information.SchDoc: Overview
size Tabloid; Author: Krutav Shah; DrawnBy: Krutav Shah; SheetNumber: 1; SheetTotal: 4; Inventory: SCH-00011
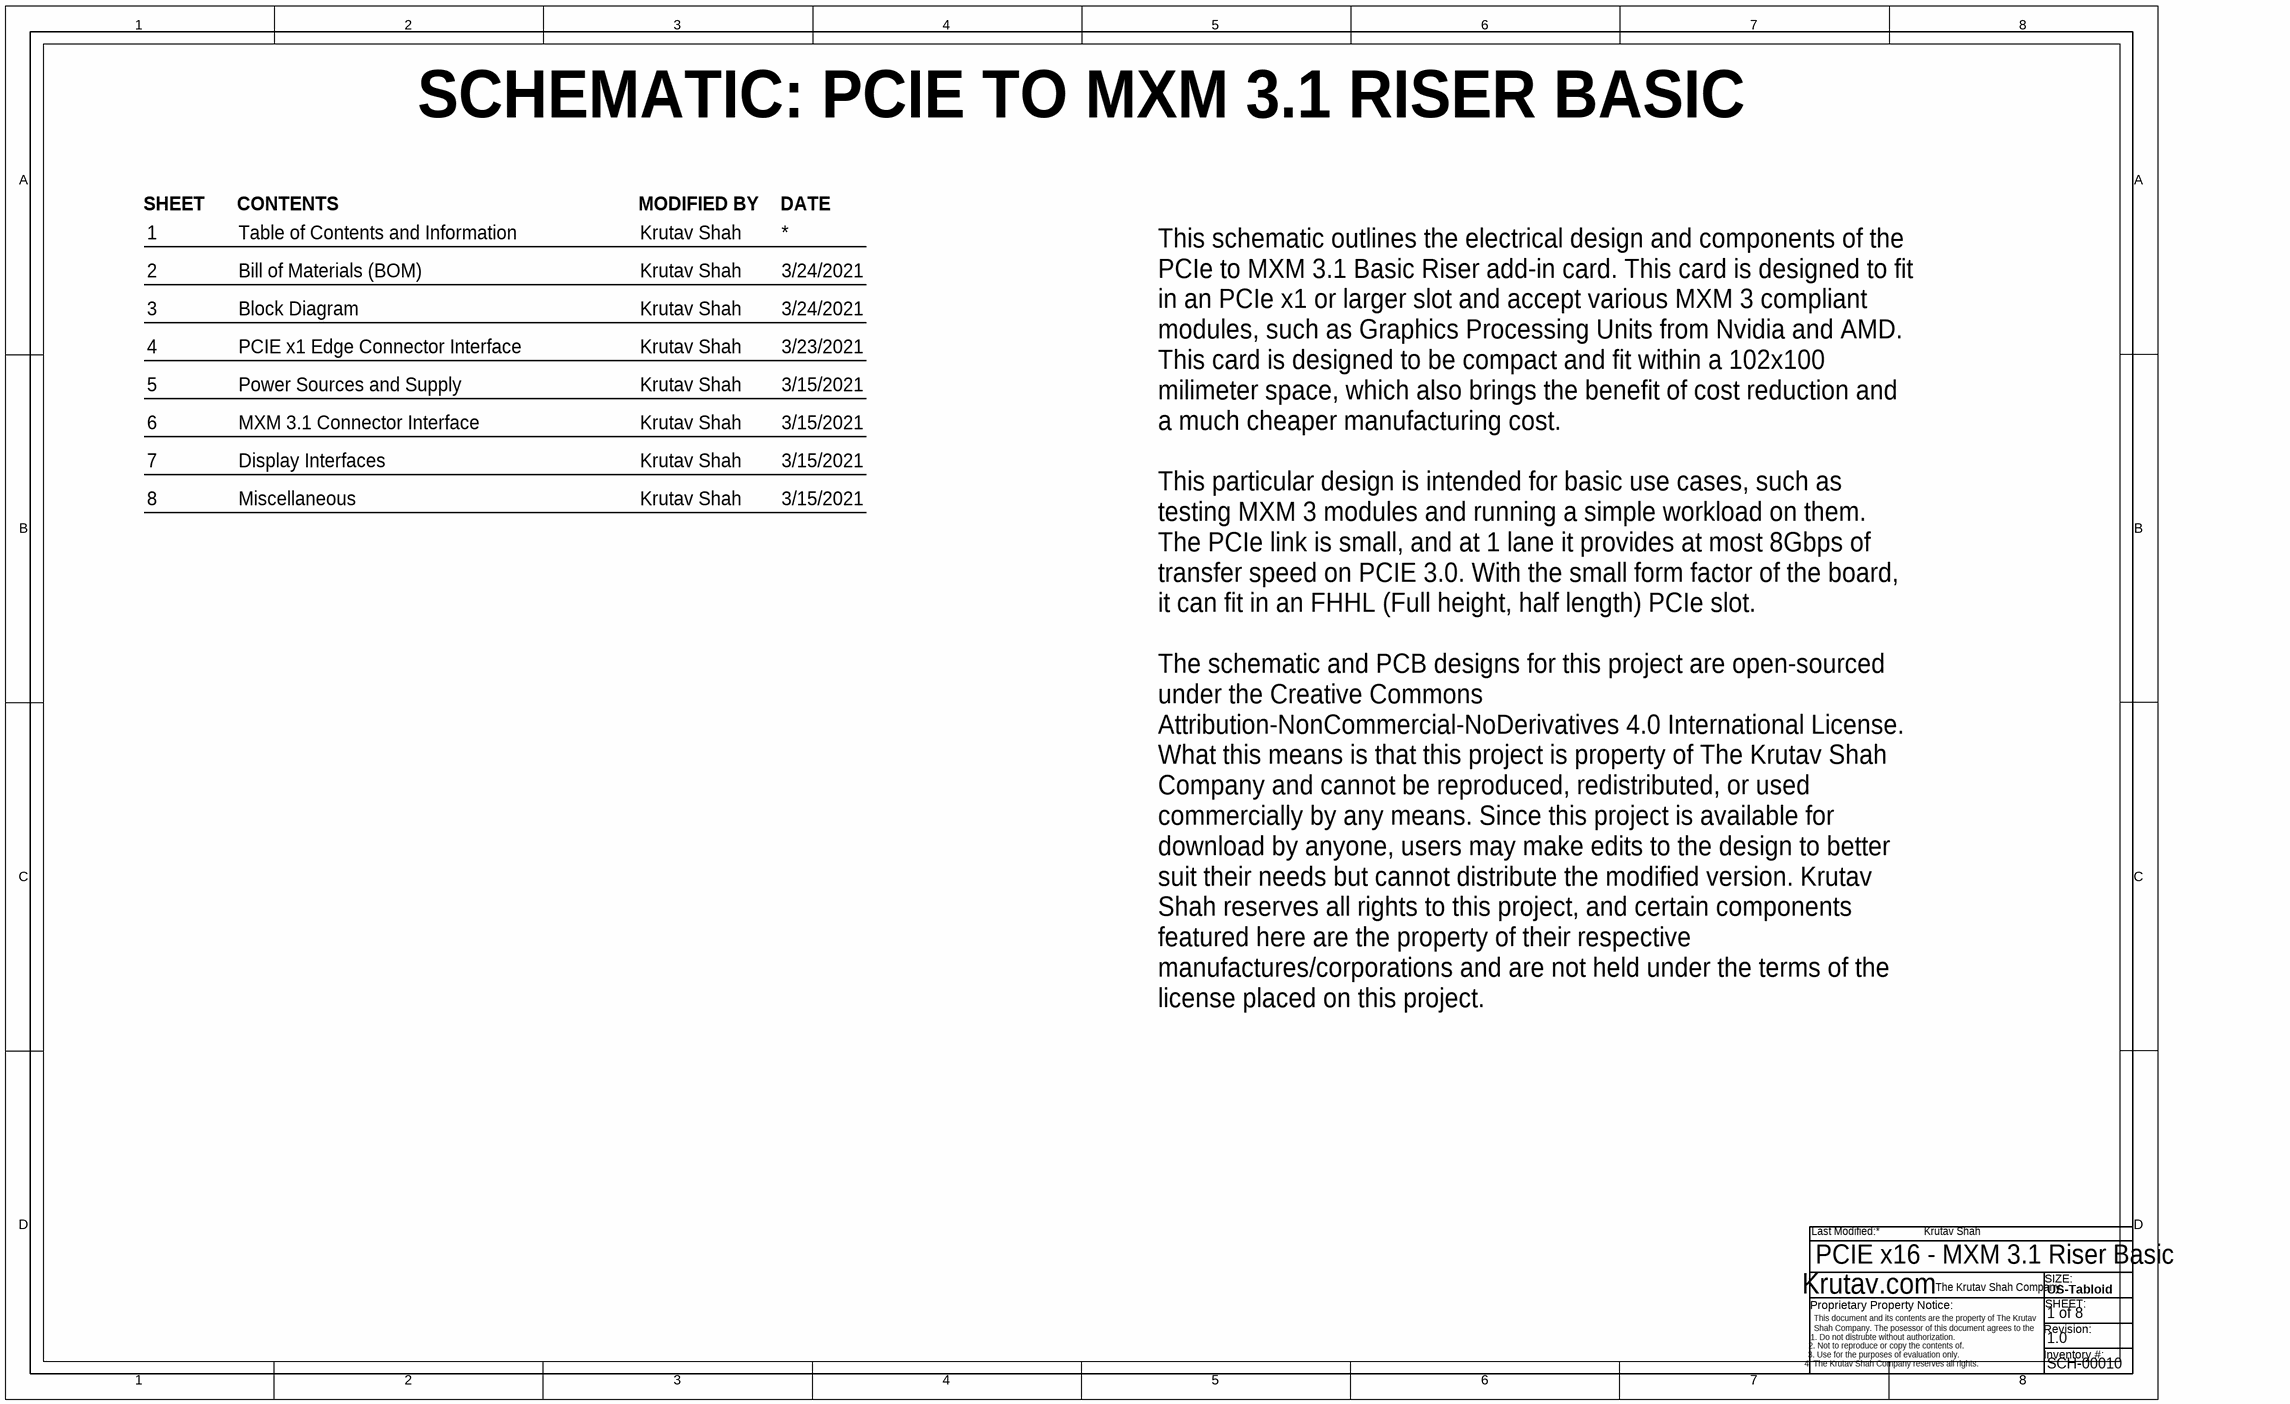
[diagram p8: Table of Contents and Information.SchDoc]

### Notes on the sheet
- SCHEMATIC: PCIE TO MXM 3.1 RISER BASIC
- SHEET
- CONTENTS
- MODIFIED BY
- DATE
- 1
- 2
- Table of Contents and Information
- Bill of Materials (BOM)
- 3/24/2021
- 3
- Block Diagram
- 4
- 5
- PCIE x1 Edge Connector Interface
- Power Sources and Supply
- 3/23/2021
- 3/15/2021
- 6
- 7
- MXM 3.1 Connector Interface
- Display Interfaces
- 8
- Miscellaneous
- This schematic outlines the electrical design and components of the PCIe to MXM 3.1 Basic Riser add-in card. This card is designed to fit in an PCIe x1 or larger slot and accept various MXM 3 compliant modules, such as Graphics Processing Units from Nvidia and AMD. This card is designed to be compact and fit within a 102x100 milimeter space, which also brings the benefit of cost reduction and a much cheaper manufacturing cost.
  This particular design is intended for basic use cases, such as testing MXM 3 modules and running a simple workload on them. The PCIe link is small, and at 1 lane it provides at most 8Gbps of transfer speed on PCIE 3.0. With the small form factor of the board, it can fit in an FHHL (Full height, half length) PCIe slot.
  The schematic and PCB designs for this project are open-sourced under the Creative Commons Attribution-NonCommercial-NoDerivatives 4.0 International License. What this means is that this project is property of The Krutav Shah Company and cannot be reproduced, redistributed, or used commercially by any means. Since this project is available for download by anyone, users may make edits to the design to better suit their needs but cannot distribute the modified version. Krutav Shah reserves all rights to this project, and certain components featured here are the property of their respective manufactures/corporations and are not held under the terms of the license placed on this project.
- PCIE x16 - MXM 3.1 Riser Basic
- 1 of 8
- 1.0
- SCH-00010
- Last Modified:
- Krutav.com
- The Krutav Shah Company
- US-Tabloid
- SIZE:
- SHEET:
- This document and its contents are the property of The Krutav Shah Company. The posessor of this document agrees to the following:
- Proprietary Property Notice:
- 1. Do not distrubte without authorization.
- 3. Use for the purposes of evaluation only.
- 2. Not to reproduce or copy the contents of.
- 4. The Krutav Shah Company reserves all rights.
- Revision:
- Inventory #:

## Nets that join several sheets
+5V: MXM 3.1 Connector Interface (J2#1.1), Power Sources and Supply (6 pins)
+12V: MXM 3.1 Connector Interface (J2#1.E1 J2#1.E2), Power Sources and Supply (6 pins)
GND: MXM 3.1 Connector Interface (75 pins), Power Sources and Supply (8 pins), MBP-Wireless-Upgrade (15 pins)